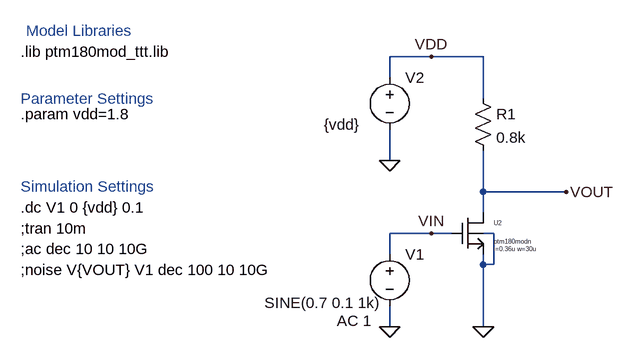
[diagram p0: schematic main.asc]
main.asc, the LTspice schematic file:
Version 4
SHEET 1 880 680
WIRE -592 160 -656 160
WIRE -512 160 -592 160
WIRE -656 192 -656 160
WIRE -512 224 -512 160
WIRE -656 320 -656 272
WIRE -512 368 -512 304
WIRE -384 368 -512 368
WIRE -512 400 -512 368
WIRE -592 432 -656 432
WIRE -560 432 -592 432
WIRE -496 432 -512 432
WIRE -656 464 -656 432
WIRE -512 480 -512 464
WIRE -496 480 -496 432
WIRE -496 480 -512 480
WIRE -656 576 -656 544
WIRE -512 576 -512 480
FLAG -512 576 0
FLAG -656 320 0
FLAG -656 576 0
FLAG -592 160 VDD
FLAG -592 432 VIN
FLAG -384 368 VOUT
SYMBOL res -528 208 R0
SYMATTR InstName R1
SYMATTR Value 0.8k
SYMBOL voltage -656 448 R0
WINDOW 3 -193 91 Left 2
WINDOW 123 -81 119 Left 2
WINDOW 39 0 0 Left 0
SYMATTR Value SINE(0.7 0.1 1k)
SYMATTR Value2 AC 1
SYMATTR InstName V1
SYMBOL voltage -656 176 R0
WINDOW 3 -101 88 Left 2
WINDOW 123 0 0 Left 0
WINDOW 39 0 0 Left 0
SYMATTR Value {vdd}
SYMATTR InstName V2
SYMBOL cnm25mod_nmos4 -560 400 R0
SYMATTR InstName U2
SYMATTR SpiceModel ptm180modn
SYMATTR Value l=0.36u w=30u
TEXT -1224 224 Left 2 ;Parameter Settings
TEXT -1224 360 Left 2 ;Simulation Settings
TEXT -1224 152 Left 2 !.lib ptm180mod_ttt.lib
TEXT -1216 120 Left 2 ;Model Libraries
TEXT -1224 392 Left 2 !.dc V1 0 {vdd} 0.1
TEXT -1224 248 Left 2 !.param vdd=1.8
TEXT -1224 456 Left 2 !;ac dec 10 10 10G
TEXT -1224 424 Left 2 !;tran 10m
TEXT -1224 488 Left 2 !;noise V{VOUT} V1 dec 100 10 10G

The netlist it stands for:
* main.asc
R1 VDD VOUT 0.8k
V1 VIN 0 SINE(0.7 0.1 1k) AC 1
V2 VDD 0 {vdd}
XU2 VOUT VIN 0 0 ptm180modn l=0.36u w=30u  ; pins D G S B
* Parameter Settings
* Simulation Settings
.lib ptm180mod_ttt.lib
* Model Libraries
.dc V1 0 {vdd} 0.1
.param vdd=1.8
;ac dec 10 10 10G
;tran 10m
;noise V{VOUT} V1 dec 100 10 10G
.backanno
.end